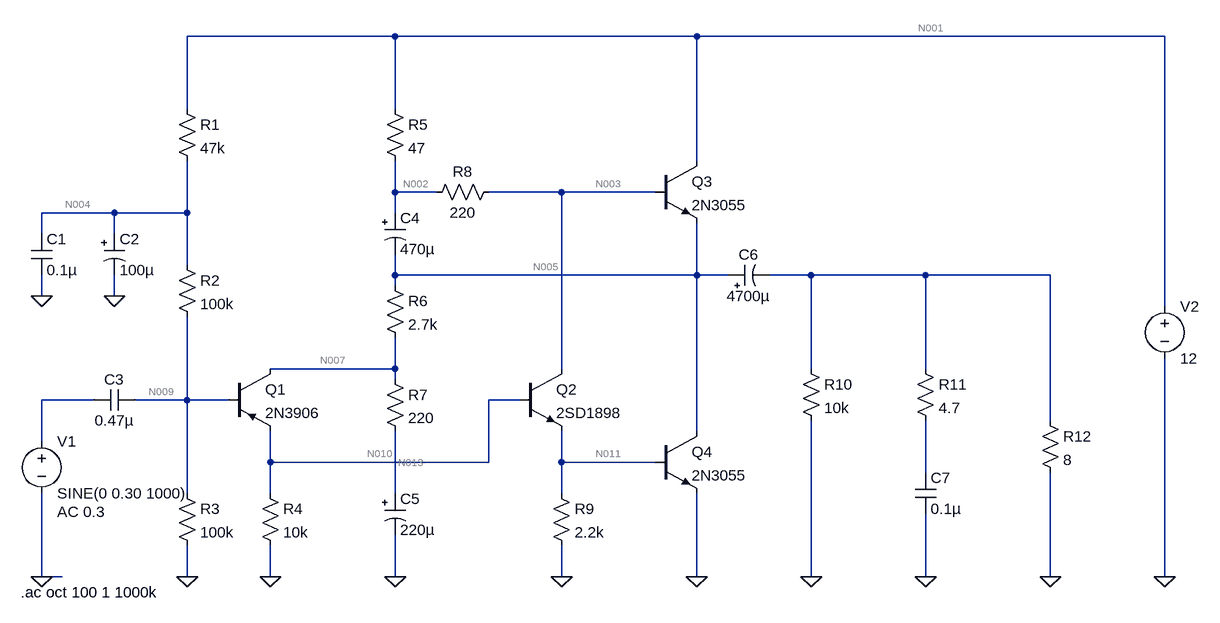
[diagram p0: schematic Amplificador_Clase_A.asc]
Amplificador_Clase_A.asc, the LTspice schematic file:
Version 4
SHEET 1 1380 680
WIRE 48 -384 -272 -384
WIRE 512 -384 48 -384
WIRE 1232 -384 512 -384
WIRE -272 -272 -272 -384
WIRE 48 -272 48 -384
WIRE 512 -192 512 -384
WIRE 48 -144 48 -192
WIRE 112 -144 48 -144
WIRE 304 -144 192 -144
WIRE 448 -144 304 -144
WIRE -384 -112 -496 -112
WIRE -272 -112 -272 -192
WIRE -272 -112 -384 -112
WIRE 48 -112 48 -144
WIRE -496 -80 -496 -112
WIRE -384 -80 -384 -112
WIRE -272 -32 -272 -112
WIRE 48 -16 48 -48
WIRE 512 -16 512 -96
WIRE 512 -16 48 -16
WIRE 560 -16 512 -16
WIRE 688 -16 624 -16
WIRE 864 -16 688 -16
WIRE 1056 -16 864 -16
WIRE 48 0 48 -16
WIRE -496 16 -496 -16
WIRE -384 16 -384 -16
WIRE 1232 32 1232 -384
WIRE 48 128 48 80
WIRE 48 128 -144 128
WIRE 304 128 304 -144
WIRE 688 128 688 -16
WIRE 864 128 864 -16
WIRE 48 144 48 128
WIRE -416 176 -496 176
WIRE -272 176 -272 48
WIRE -272 176 -352 176
WIRE -208 176 -272 176
WIRE 240 176 192 176
WIRE 1056 208 1056 -16
WIRE 512 224 512 -16
WIRE -496 240 -496 176
WIRE -144 272 -144 224
WIRE 192 272 192 176
WIRE 192 272 -144 272
WIRE 304 272 304 224
WIRE 448 272 304 272
WIRE 864 288 864 208
WIRE -272 320 -272 176
WIRE -144 320 -144 272
WIRE 48 320 48 224
WIRE 304 320 304 272
WIRE -496 448 -496 320
WIRE -464 448 -496 448
WIRE -272 448 -272 400
WIRE -144 448 -144 400
WIRE 48 448 48 384
WIRE 304 448 304 400
WIRE 512 448 512 320
WIRE 688 448 688 208
WIRE 864 448 864 352
WIRE 1056 448 1056 288
WIRE 1232 448 1232 112
FLAG -272 448 0
FLAG -144 448 0
FLAG 48 448 0
FLAG 304 448 0
FLAG 512 448 0
FLAG 688 448 0
FLAG 864 448 0
FLAG -384 16 0
FLAG -496 16 0
FLAG 1232 448 0
FLAG 1056 448 0
FLAG -496 448 0
DATAFLAG 848 -16 ""
DATAFLAG 400 -144 ""
DATAFLAG 368 272 ""
DATAFLAG 512 96 ""
DATAFLAG 1056 112 ""
DATAFLAG -16 128 ""
DATAFLAG 48 -320 ""
DATAFLAG -272 112 ""
DATAFLAG 512 -64 ""
SYMBOL pnp -208 128 R0
SYMATTR InstName Q1
SYMATTR Value 2N3906
SYMBOL npn 240 128 R0
SYMATTR InstName Q2
SYMATTR Value 2SD1898
SYMBOL npn 448 -192 R0
SYMATTR InstName Q3
SYMATTR Value 2N3055
SYMBOL npn 448 224 R0
SYMATTR InstName Q4
SYMATTR Value 2N3055
SYMBOL res -288 -288 R0
SYMATTR InstName R1
SYMATTR Value 47k
SYMATTR SpiceLine pwr=0.5
SYMBOL res -288 -48 R0
SYMATTR InstName R2
SYMATTR Value 100k
SYMATTR SpiceLine pwr=0.5
SYMBOL res -288 304 R0
SYMATTR InstName R3
SYMATTR Value 100k
SYMATTR SpiceLine pwr=0.5
SYMBOL res -160 304 R0
SYMATTR InstName R4
SYMATTR Value 10k
SYMATTR SpiceLine pwr=0.5
SYMBOL res 32 -288 R0
SYMATTR InstName R5
SYMATTR Value 47
SYMATTR SpiceLine pwr=0.5
SYMBOL res 32 -16 R0
SYMATTR InstName R6
SYMATTR Value 2.7k
SYMATTR SpiceLine pwr=0.5
SYMBOL res 32 128 R0
SYMATTR InstName R7
SYMATTR Value 220
SYMATTR SpiceLine pwr=0.5
SYMBOL res 208 -160 R90
WINDOW 0 0 56 VBottom 2
WINDOW 3 32 56 VTop 2
SYMATTR InstName R8
SYMATTR Value 220
SYMATTR SpiceLine pwr=0.5
SYMBOL res 288 304 R0
SYMATTR InstName R9
SYMATTR Value 2.2k
SYMATTR SpiceLine pwr=0.5
SYMBOL res 672 112 R0
SYMATTR InstName R10
SYMATTR Value 10k
SYMATTR SpiceLine pwr=0.5
SYMBOL res 848 112 R0
SYMATTR InstName R11
SYMATTR Value 4.7
SYMATTR SpiceLine pwr=0.5
SYMBOL cap -512 -80 R0
SYMATTR InstName C1
SYMATTR Value 0.1µ
SYMATTR SpiceLine V=16 Irms=1.78 Rser=0.0675534 Lser=0 mfg="KEMET" pn="C1210F104K4RAC" type="X7R"
SYMBOL polcap -400 -80 R0
WINDOW 3 24 56 Left 2
SYMATTR Value 100µ
SYMATTR InstName C2
SYMATTR Description Capacitor
SYMATTR Type cap
SYMATTR SpiceLine V=16 Irms=135m Rser=0.8 Lser=0 mfg="Nichicon" pn="UPR1C101MPH" type="Al electrolytic"
SYMBOL cap -352 160 R90
WINDOW 0 0 32 VBottom 2
WINDOW 3 32 32 VTop 2
SYMATTR InstName C3
SYMATTR Value 0.47µ
SYMATTR SpiceLine V=16 Irms=0 Rser=0 Lser=0 mfg="Murata" pn="GRM033R61C103KA12" type="X5R"
SYMBOL polcap 32 -112 R0
SYMATTR InstName C4
SYMATTR Value 470µ
SYMATTR Description Capacitor
SYMATTR Type cap
SYMATTR SpiceLine V=16 Irms=770m Rser=0.09 Lser=0 mfg="Nichicon" pn="UPL1C471MPH6" type="Al electrolytic"
SYMBOL polcap 32 320 R0
WINDOW 3 24 56 Left 2
SYMATTR Value 220µ
SYMATTR InstName C5
SYMATTR Description Capacitor
SYMATTR Type cap
SYMATTR SpiceLine V=16 Irms=460m Rser=0.16 Lser=0 mfg="Nichicon" pn="UPL1C221MPH" type="Al electrolytic"
SYMBOL polcap 560 0 R270
WINDOW 0 32 32 VTop 2
WINDOW 3 0 32 VBottom 2
SYMATTR InstName C6
SYMATTR Value 4700µ
SYMATTR Description Capacitor
SYMATTR Type cap
SYMATTR SpiceLine V=16 Irms=2.68 Rser=0.02 Lser=0 mfg="Nichicon" pn="UPL1C472MRH" type="Al electrolytic"
SYMBOL cap 848 288 R0
SYMATTR InstName C7
SYMATTR Value 0.1µ
SYMATTR SpiceLine V=16 Irms=728m Rser=0.14361 Lser=0 mfg="KEMET" pn="C0603C104K4RAC" type="X7R"
SYMBOL voltage -496 224 R0
WINDOW 123 24 124 Left 2
WINDOW 39 0 0 Left 0
SYMATTR Value2 AC 0.3
SYMATTR InstName V1
SYMATTR Value SINE(0 0.30 1000)
SYMBOL res 1040 192 R0
SYMATTR InstName R12
SYMATTR Value 8
SYMATTR SpiceLine pwr=10
SYMBOL voltage 1232 16 R0
WINDOW 123 0 0 Left 0
WINDOW 39 0 0 Left 0
SYMATTR InstName V2
SYMATTR Value 12
TEXT -528 472 Left 2 !.ac oct 100 1 1000k

The netlist it stands for:
* Amplificador_Clase_A.asc
Q1 N007 N009 N010 0 2N3906
Q2 N003 N010 N011 0 2SD1898
Q3 N001 N003 N005 0 2N3055
Q4 N005 N011 0 0 2N3055
R1 N001 N004 47k pwr=0.5
R2 N004 N009 100k pwr=0.5
R3 N009 0 100k pwr=0.5
R4 N010 0 10k pwr=0.5
R5 N001 N002 47 pwr=0.5
R6 N005 N007 2.7k pwr=0.5
R7 N007 N013 220 pwr=0.5
R8 N003 N002 220 pwr=0.5
R9 N011 0 2.2k pwr=0.5
R10 N006 0 10k pwr=0.5
R11 N006 N012 4.7 pwr=0.5
C1 N004 0 0.1µ V=16 Irms=1.78 Rser=0.0675534 Lser=0 mfg="KEMET" pn="C1210F104K4RAC" type="X7R"
C2 N004 0 100µ V=16 Irms=135m Rser=0.8 Lser=0 mfg="Nichicon" pn="UPR1C101MPH" type="Al electrolytic"
C3 N009 N008 0.47µ V=16 Irms=0 Rser=0 Lser=0 mfg="Murata" pn="GRM033R61C103KA12" type="X5R"
C4 N002 N005 470µ V=16 Irms=770m Rser=0.09 Lser=0 mfg="Nichicon" pn="UPL1C471MPH6" type="Al electrolytic"
C5 N013 0 220µ V=16 Irms=460m Rser=0.16 Lser=0 mfg="Nichicon" pn="UPL1C221MPH" type="Al electrolytic"
C6 N005 N006 4700µ V=16 Irms=2.68 Rser=0.02 Lser=0 mfg="Nichicon" pn="UPL1C472MRH" type="Al electrolytic"
C7 N012 0 0.1µ V=16 Irms=728m Rser=0.14361 Lser=0 mfg="KEMET" pn="C0603C104K4RAC" type="X7R"
V1 N008 0 SINE(0 0.30 1000) AC 0.3
R12 N006 0 8 pwr=10
V2 N001 0 12
.model NPN NPN
.model PNP PNP
.lib standard.bjt
.ac oct 100 1 1000k
.backanno
.end

* Results of the author's LTspice run, read from the files saved beside the schematic
* Operating Point, zero values left out:
*   V(n007) = 7.498 V
*   V(n009) = 6.894 V
*   V(n010) = 1.057 V
*   V(n003) = 8.398 V
*   V(n011) = 441.5 mV
*   V(n001) = 12 V
*   V(n005) = 7.957 V
*   V(n004) = 10.37 V
*   V(n002) = 11.37 V
*   V(n013) = 7.498 V
*   Ic(Q4) = 361.2 mA
*   Ib(Q4) = 6.735 mA
*   Ie(Q4) = -367.9 mA
*   Ic(Q3) = 354.8 mA
*   Ib(Q3) = 6.584 mA
*   Ie(Q3) = -361.4 mA
*   Ic(Q2) = 6.905 mA
*   Ib(Q2) = 30.31 µA
*   Ie(Q2) = -6.936 mA
*   Ic(Q1) = 170.2 µA
*   Ib(Q1) = -34.2 µA
*   Ie(Q1) = -136 µA
*   I(R9) = 200.7 µA
*   I(R8) = -13.49 mA
*   I(R6) = 170.2 µA
*   I(R5) = 13.49 mA
*   I(R4) = 105.7 µA
*   I(R3) = 68.94 µA
*   I(R2) = 34.74 µA
*   I(R1) = 34.74 µA
*   I(V2) = -368.3 mA
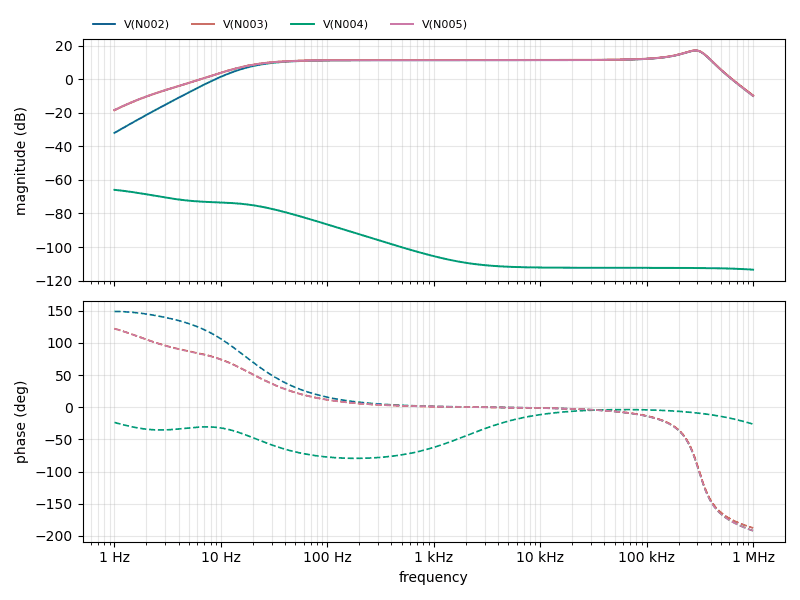
[diagram p1: AC Analysis of Amplificador_Clase_A.asc, plotted from the saved traces]
* AC Analysis, 1 run:
*   V(N002): -31.91 dB at 1 Hz, -9.85 dB at 1 MHz, peak 17.23 dB at 286.9 kHz, 3 dB below the peak at 182.9 kHz and 360.3 kHz
*   V(N003): -18.32 dB at 1 Hz, -9.58 dB at 1 MHz, peak 17.31 dB at 286.9 kHz, 3 dB below the peak at 183 kHz and 360.4 kHz
*   V(N004): -65.89 dB at 1 Hz, -113.53 dB at 1 MHz, peak -65.89 dB at 1 Hz, 3 dB below the peak at 2.142 Hz
*   V(N005): -18.25 dB at 1 Hz, -9.84 dB at 1 MHz, peak 17.24 dB at 286.9 kHz, 3 dB below the peak at 182.9 kHz and 360.3 kHz